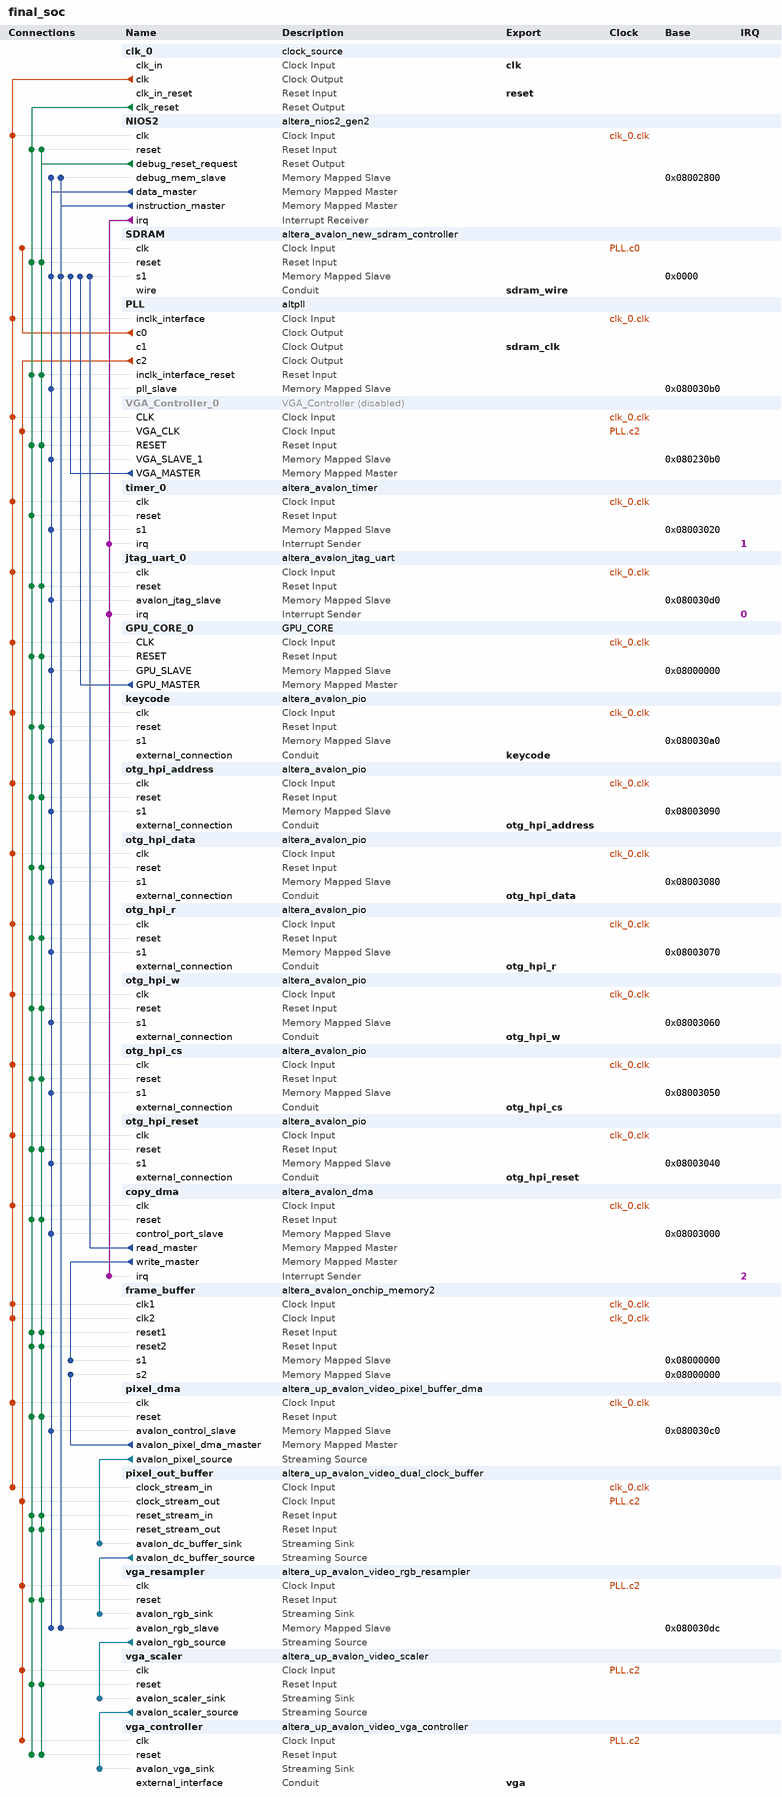
[diagram p0: system contents]
# Platform Designer (Qsys) system final_soc, Cyclone IV E EP4CE115F29C7
# Parameters at their usual value, and those the tool derives, are not listed.
package require -exact qsys 18.1
create_system final_soc
set_project_property DEVICE_FAMILY {Cyclone IV E}
set_project_property DEVICE EP4CE115F29C7

add_instance clk_0 clock_source 18.1
set_instance_parameter_value clk_0 clockFrequency 50000000

add_instance NIOS2 altera_nios2_gen2 18.1
set_instance_parameter_value NIOS2 dcache_size 2048
set_instance_parameter_value NIOS2 dividerType srt2
set_instance_parameter_value NIOS2 exceptionSlave SDRAM.s1
set_instance_parameter_value NIOS2 icache_size 4096
set_instance_parameter_value NIOS2 impl Tiny
set_instance_parameter_value NIOS2 mul_64_impl 1
set_instance_parameter_value NIOS2 mul_shift_choice 1
set_instance_parameter_value NIOS2 resetSlave SDRAM.s1

add_instance SDRAM altera_avalon_new_sdram_controller 18.1
set_instance_parameter_value SDRAM TAC 5.5
set_instance_parameter_value SDRAM TRCD 20.0
set_instance_parameter_value SDRAM TRP 20.0
set_instance_parameter_value SDRAM casLatency 3
set_instance_parameter_value SDRAM columnWidth 10
set_instance_parameter_value SDRAM dataWidth 32
set_instance_parameter_value SDRAM generateSimulationModel false
set_instance_parameter_value SDRAM model single_Micron_MT48LC4M32B2_7_chip
set_instance_parameter_value SDRAM numberOfBanks 4
set_instance_parameter_value SDRAM numberOfChipSelects 1
set_instance_parameter_value SDRAM powerUpDelay 200.0
set_instance_parameter_value SDRAM refreshPeriod 7.8125
set_instance_parameter_value SDRAM rowWidth 13

add_instance PLL altpll 18.1
set_instance_parameter_value PLL CLK0_DIVIDE_BY 1
set_instance_parameter_value PLL CLK0_MULTIPLY_BY 1
set_instance_parameter_value PLL CLK1_DIVIDE_BY 1
set_instance_parameter_value PLL CLK1_DUTY_CYCLE 50
set_instance_parameter_value PLL CLK1_MULTIPLY_BY 1
set_instance_parameter_value PLL CLK1_PHASE_SHIFT -3000
set_instance_parameter_value PLL CLK2_DIVIDE_BY 2
set_instance_parameter_value PLL CLK2_DUTY_CYCLE 50
set_instance_parameter_value PLL CLK2_MULTIPLY_BY 1
set_instance_parameter_value PLL CLK2_PHASE_SHIFT 0
set_instance_parameter_value PLL CLK3_DIVIDE_BY 2
set_instance_parameter_value PLL CLK3_DUTY_CYCLE 50
set_instance_parameter_value PLL CLK3_MULTIPLY_BY 1
set_instance_parameter_value PLL CLK3_PHASE_SHIFT 0
set_instance_parameter_value PLL CLK4_DIVIDE_BY 1
set_instance_parameter_value PLL CLK4_DUTY_CYCLE 50
set_instance_parameter_value PLL CLK4_MULTIPLY_BY 4
set_instance_parameter_value PLL CLK4_PHASE_SHIFT 0
set_instance_parameter_value PLL INCLK0_INPUT_FREQUENCY 20000
set_instance_parameter_value PLL PORT_ARESET PORT_UNUSED
set_instance_parameter_value PLL PORT_LOCKED PORT_UNUSED
set_instance_parameter_value PLL PORT_clk1 PORT_USED
set_instance_parameter_value PLL PORT_clk2 PORT_USED
set_instance_parameter_value PLL PORT_clk3 PORT_USED
set_instance_parameter_value PLL PORT_clk4 PORT_USED

add_instance VGA_Controller_0 VGA_Controller 1.0
set_instance_property VGA_Controller_0 ENABLED false

add_instance timer_0 altera_avalon_timer 18.1
set_instance_parameter_value timer_0 period 1
set_instance_parameter_value timer_0 periodUnits MSEC

add_instance jtag_uart_0 altera_avalon_jtag_uart 18.1
set_instance_parameter_value jtag_uart_0 simInteractiveOptions NO_INTERACTIVE_WINDOWS

add_instance GPU_CORE_0 GPU_CORE 1.0

add_instance keycode altera_avalon_pio 18.1
set_instance_parameter_value keycode direction Output
set_instance_parameter_value keycode width 8

add_instance otg_hpi_address altera_avalon_pio 18.1
set_instance_parameter_value otg_hpi_address direction Output
set_instance_parameter_value otg_hpi_address width 2

add_instance otg_hpi_data altera_avalon_pio 18.1
set_instance_parameter_value otg_hpi_data direction InOut
set_instance_parameter_value otg_hpi_data width 16

add_instance otg_hpi_r altera_avalon_pio 18.1
set_instance_parameter_value otg_hpi_r direction Output
set_instance_parameter_value otg_hpi_r width 1

add_instance otg_hpi_w altera_avalon_pio 18.1
set_instance_parameter_value otg_hpi_w direction Output
set_instance_parameter_value otg_hpi_w width 1

add_instance otg_hpi_cs altera_avalon_pio 18.1
set_instance_parameter_value otg_hpi_cs direction Output
set_instance_parameter_value otg_hpi_cs width 1

add_instance otg_hpi_reset altera_avalon_pio 18.1
set_instance_parameter_value otg_hpi_reset direction Output
set_instance_parameter_value otg_hpi_reset width 1

add_instance copy_dma altera_avalon_dma 18.1
set_instance_parameter_value copy_dma allowByteTransactions true
set_instance_parameter_value copy_dma allowDoubleWordTransactions true
set_instance_parameter_value copy_dma allowHalfWordTransactions true
set_instance_parameter_value copy_dma allowQuadWordTransactions true
set_instance_parameter_value copy_dma burstEnable false
set_instance_parameter_value copy_dma fifoDepth 1024
set_instance_parameter_value copy_dma maxBurstSize 1024
set_instance_parameter_value copy_dma minimumDmaTransactionRegisterWidth 32

add_instance frame_buffer altera_avalon_onchip_memory2 18.1
set_instance_parameter_value frame_buffer dataWidth 32
set_instance_parameter_value frame_buffer dualPort true
set_instance_parameter_value frame_buffer initMemContent false
set_instance_parameter_value frame_buffer initializationFileName onchip_mem.hex
set_instance_parameter_value frame_buffer memorySize 307200

add_instance pixel_dma altera_up_avalon_video_pixel_buffer_dma 18.0
set_instance_parameter_value pixel_dma addr_mode Consecutive
set_instance_parameter_value pixel_dma back_start_address 134217728
set_instance_parameter_value pixel_dma color_space {32-bit RGBA}
set_instance_parameter_value pixel_dma image_height 240
set_instance_parameter_value pixel_dma image_width 320
set_instance_parameter_value pixel_dma start_address 134217728

add_instance pixel_out_buffer altera_up_avalon_video_dual_clock_buffer 18.0
set_instance_parameter_value pixel_out_buffer color_bits 8
set_instance_parameter_value pixel_out_buffer color_planes 4

add_instance vga_resampler altera_up_avalon_video_rgb_resampler 18.0
set_instance_parameter_value vga_resampler alpha 1023
set_instance_parameter_value vga_resampler input_type {32-bit RGBA}
set_instance_parameter_value vga_resampler output_type {30-bit RGB}

add_instance vga_scaler altera_up_avalon_video_scaler 18.0
set_instance_parameter_value vga_scaler color_bits 10
set_instance_parameter_value vga_scaler color_planes 3
set_instance_parameter_value vga_scaler height_scaling 2
set_instance_parameter_value vga_scaler width_in 320
set_instance_parameter_value vga_scaler width_scaling 2

add_instance vga_controller altera_up_avalon_video_vga_controller 18.0
set_instance_parameter_value vga_controller board DE2-115
set_instance_parameter_value vga_controller resolution {VGA 640x480}

# connections
add_connection clk_0.clk copy_dma.clk clock
add_connection clk_0.clk frame_buffer.clk1 clock
add_connection clk_0.clk frame_buffer.clk2 clock
add_connection clk_0.clk GPU_CORE_0.CLK clock
add_connection clk_0.clk jtag_uart_0.clk clock
add_connection clk_0.clk keycode.clk clock
add_connection clk_0.clk NIOS2.clk clock
add_connection clk_0.clk otg_hpi_address.clk clock
add_connection clk_0.clk otg_hpi_cs.clk clock
add_connection clk_0.clk otg_hpi_data.clk clock
add_connection clk_0.clk otg_hpi_r.clk clock
add_connection clk_0.clk otg_hpi_reset.clk clock
add_connection clk_0.clk otg_hpi_w.clk clock
add_connection clk_0.clk pixel_dma.clk clock
add_connection clk_0.clk pixel_out_buffer.clock_stream_in clock
add_connection clk_0.clk PLL.inclk_interface clock
add_connection clk_0.clk timer_0.clk clock
add_connection clk_0.clk VGA_Controller_0.CLK clock
add_connection PLL.c0 SDRAM.clk clock
add_connection PLL.c2 pixel_out_buffer.clock_stream_out clock
add_connection PLL.c2 vga_controller.clk clock
add_connection PLL.c2 VGA_Controller_0.VGA_CLK clock
add_connection PLL.c2 vga_resampler.clk clock
add_connection PLL.c2 vga_scaler.clk clock
add_connection clk_0.clk_reset copy_dma.reset reset
add_connection clk_0.clk_reset frame_buffer.reset1 reset
add_connection clk_0.clk_reset frame_buffer.reset2 reset
add_connection clk_0.clk_reset GPU_CORE_0.RESET reset
add_connection clk_0.clk_reset jtag_uart_0.reset reset
add_connection clk_0.clk_reset keycode.reset reset
add_connection clk_0.clk_reset NIOS2.reset reset
add_connection clk_0.clk_reset otg_hpi_address.reset reset
add_connection clk_0.clk_reset otg_hpi_cs.reset reset
add_connection clk_0.clk_reset otg_hpi_data.reset reset
add_connection clk_0.clk_reset otg_hpi_r.reset reset
add_connection clk_0.clk_reset otg_hpi_reset.reset reset
add_connection clk_0.clk_reset otg_hpi_w.reset reset
add_connection clk_0.clk_reset pixel_dma.reset reset
add_connection clk_0.clk_reset pixel_out_buffer.reset_stream_in reset
add_connection clk_0.clk_reset pixel_out_buffer.reset_stream_out reset
add_connection clk_0.clk_reset PLL.inclk_interface_reset reset
add_connection clk_0.clk_reset SDRAM.reset reset
add_connection clk_0.clk_reset timer_0.reset reset
add_connection clk_0.clk_reset vga_controller.reset reset
add_connection clk_0.clk_reset VGA_Controller_0.RESET reset
add_connection clk_0.clk_reset vga_resampler.reset reset
add_connection clk_0.clk_reset vga_scaler.reset reset
add_connection NIOS2.debug_reset_request copy_dma.reset reset
add_connection NIOS2.debug_reset_request frame_buffer.reset1 reset
add_connection NIOS2.debug_reset_request frame_buffer.reset2 reset
add_connection NIOS2.debug_reset_request GPU_CORE_0.RESET reset
add_connection NIOS2.debug_reset_request jtag_uart_0.reset reset
add_connection NIOS2.debug_reset_request keycode.reset reset
add_connection NIOS2.debug_reset_request NIOS2.reset reset
add_connection NIOS2.debug_reset_request otg_hpi_address.reset reset
add_connection NIOS2.debug_reset_request otg_hpi_cs.reset reset
add_connection NIOS2.debug_reset_request otg_hpi_data.reset reset
add_connection NIOS2.debug_reset_request otg_hpi_r.reset reset
add_connection NIOS2.debug_reset_request otg_hpi_reset.reset reset
add_connection NIOS2.debug_reset_request otg_hpi_w.reset reset
add_connection NIOS2.debug_reset_request pixel_dma.reset reset
add_connection NIOS2.debug_reset_request pixel_out_buffer.reset_stream_in reset
add_connection NIOS2.debug_reset_request pixel_out_buffer.reset_stream_out reset
add_connection NIOS2.debug_reset_request PLL.inclk_interface_reset reset
add_connection NIOS2.debug_reset_request SDRAM.reset reset
add_connection NIOS2.debug_reset_request vga_controller.reset reset
add_connection NIOS2.debug_reset_request VGA_Controller_0.RESET reset
add_connection NIOS2.debug_reset_request vga_resampler.reset reset
add_connection NIOS2.debug_reset_request vga_scaler.reset reset
add_connection copy_dma.read_master SDRAM.s1 avalon
set_connection_parameter_value copy_dma.read_master/SDRAM.s1 baseAddress 0x0000
add_connection copy_dma.write_master frame_buffer.s1 avalon
set_connection_parameter_value copy_dma.write_master/frame_buffer.s1 baseAddress 0x08000000
add_connection GPU_CORE_0.GPU_MASTER SDRAM.s1 avalon
set_connection_parameter_value GPU_CORE_0.GPU_MASTER/SDRAM.s1 baseAddress 0x0000
add_connection NIOS2.data_master copy_dma.control_port_slave avalon
set_connection_parameter_value NIOS2.data_master/copy_dma.control_port_slave baseAddress 0x08003000
add_connection NIOS2.data_master GPU_CORE_0.GPU_SLAVE avalon
set_connection_parameter_value NIOS2.data_master/GPU_CORE_0.GPU_SLAVE baseAddress 0x08000000
add_connection NIOS2.data_master jtag_uart_0.avalon_jtag_slave avalon
set_connection_parameter_value NIOS2.data_master/jtag_uart_0.avalon_jtag_slave baseAddress 0x080030d0
add_connection NIOS2.data_master keycode.s1 avalon
set_connection_parameter_value NIOS2.data_master/keycode.s1 baseAddress 0x080030a0
add_connection NIOS2.data_master NIOS2.debug_mem_slave avalon
set_connection_parameter_value NIOS2.data_master/NIOS2.debug_mem_slave baseAddress 0x08002800
add_connection NIOS2.data_master otg_hpi_address.s1 avalon
set_connection_parameter_value NIOS2.data_master/otg_hpi_address.s1 baseAddress 0x08003090
add_connection NIOS2.data_master otg_hpi_cs.s1 avalon
set_connection_parameter_value NIOS2.data_master/otg_hpi_cs.s1 baseAddress 0x08003050
add_connection NIOS2.data_master otg_hpi_data.s1 avalon
set_connection_parameter_value NIOS2.data_master/otg_hpi_data.s1 baseAddress 0x08003080
add_connection NIOS2.data_master otg_hpi_r.s1 avalon
set_connection_parameter_value NIOS2.data_master/otg_hpi_r.s1 baseAddress 0x08003070
add_connection NIOS2.data_master otg_hpi_reset.s1 avalon
set_connection_parameter_value NIOS2.data_master/otg_hpi_reset.s1 baseAddress 0x08003040
add_connection NIOS2.data_master otg_hpi_w.s1 avalon
set_connection_parameter_value NIOS2.data_master/otg_hpi_w.s1 baseAddress 0x08003060
add_connection NIOS2.data_master pixel_dma.avalon_control_slave avalon
set_connection_parameter_value NIOS2.data_master/pixel_dma.avalon_control_slave baseAddress 0x080030c0
add_connection NIOS2.data_master PLL.pll_slave avalon
set_connection_parameter_value NIOS2.data_master/PLL.pll_slave baseAddress 0x080030b0
add_connection NIOS2.data_master SDRAM.s1 avalon
set_connection_parameter_value NIOS2.data_master/SDRAM.s1 baseAddress 0x0000
add_connection NIOS2.data_master timer_0.s1 avalon
set_connection_parameter_value NIOS2.data_master/timer_0.s1 baseAddress 0x08003020
add_connection NIOS2.data_master VGA_Controller_0.VGA_SLAVE_1 avalon
set_connection_parameter_value NIOS2.data_master/VGA_Controller_0.VGA_SLAVE_1 baseAddress 0x080230b0
add_connection NIOS2.data_master vga_resampler.avalon_rgb_slave avalon
set_connection_parameter_value NIOS2.data_master/vga_resampler.avalon_rgb_slave baseAddress 0x080030dc
add_connection NIOS2.instruction_master NIOS2.debug_mem_slave avalon
set_connection_parameter_value NIOS2.instruction_master/NIOS2.debug_mem_slave baseAddress 0x08002800
add_connection NIOS2.instruction_master SDRAM.s1 avalon
set_connection_parameter_value NIOS2.instruction_master/SDRAM.s1 baseAddress 0x0000
add_connection NIOS2.instruction_master vga_resampler.avalon_rgb_slave avalon
set_connection_parameter_value NIOS2.instruction_master/vga_resampler.avalon_rgb_slave baseAddress 0x080030dc
add_connection pixel_dma.avalon_pixel_dma_master frame_buffer.s2 avalon
set_connection_parameter_value pixel_dma.avalon_pixel_dma_master/frame_buffer.s2 baseAddress 0x08000000
add_connection VGA_Controller_0.VGA_MASTER SDRAM.s1 avalon
set_connection_parameter_value VGA_Controller_0.VGA_MASTER/SDRAM.s1 baseAddress 0x0000
add_connection pixel_dma.avalon_pixel_source pixel_out_buffer.avalon_dc_buffer_sink avalon_streaming
add_connection pixel_out_buffer.avalon_dc_buffer_source vga_resampler.avalon_rgb_sink avalon_streaming
add_connection vga_resampler.avalon_rgb_source vga_scaler.avalon_scaler_sink avalon_streaming
add_connection vga_scaler.avalon_scaler_source vga_controller.avalon_vga_sink avalon_streaming
add_connection NIOS2.irq copy_dma.irq interrupt
set_connection_parameter_value NIOS2.irq/copy_dma.irq irqNumber 2
add_connection NIOS2.irq jtag_uart_0.irq interrupt
set_connection_parameter_value NIOS2.irq/jtag_uart_0.irq irqNumber 0
add_connection NIOS2.irq timer_0.irq interrupt
set_connection_parameter_value NIOS2.irq/timer_0.irq irqNumber 1

# exported interfaces
add_interface clk clock sink
set_interface_property clk EXPORT_OF clk_0.clk_in
add_interface keycode conduit end
set_interface_property keycode EXPORT_OF keycode.external_connection
add_interface otg_hpi_address conduit end
set_interface_property otg_hpi_address EXPORT_OF otg_hpi_address.external_connection
add_interface otg_hpi_cs conduit end
set_interface_property otg_hpi_cs EXPORT_OF otg_hpi_cs.external_connection
add_interface otg_hpi_data conduit end
set_interface_property otg_hpi_data EXPORT_OF otg_hpi_data.external_connection
add_interface otg_hpi_r conduit end
set_interface_property otg_hpi_r EXPORT_OF otg_hpi_r.external_connection
add_interface otg_hpi_reset conduit end
set_interface_property otg_hpi_reset EXPORT_OF otg_hpi_reset.external_connection
add_interface otg_hpi_w conduit end
set_interface_property otg_hpi_w EXPORT_OF otg_hpi_w.external_connection
add_interface reset reset sink
set_interface_property reset EXPORT_OF clk_0.clk_in_reset
add_interface sdram_clk clock source
set_interface_property sdram_clk EXPORT_OF PLL.c1
add_interface sdram_wire conduit end
set_interface_property sdram_wire EXPORT_OF SDRAM.wire
add_interface vga conduit end
set_interface_property vga EXPORT_OF vga_controller.external_interface

set_interconnect_requirement {$system} qsys_mm.clockCrossingAdapter HANDSHAKE
set_interconnect_requirement {$system} qsys_mm.enableEccProtection FALSE
set_interconnect_requirement {$system} qsys_mm.insertDefaultSlave FALSE
set_interconnect_requirement {$system} qsys_mm.maxAdditionalLatency 1

save_system final_soc.qsys
